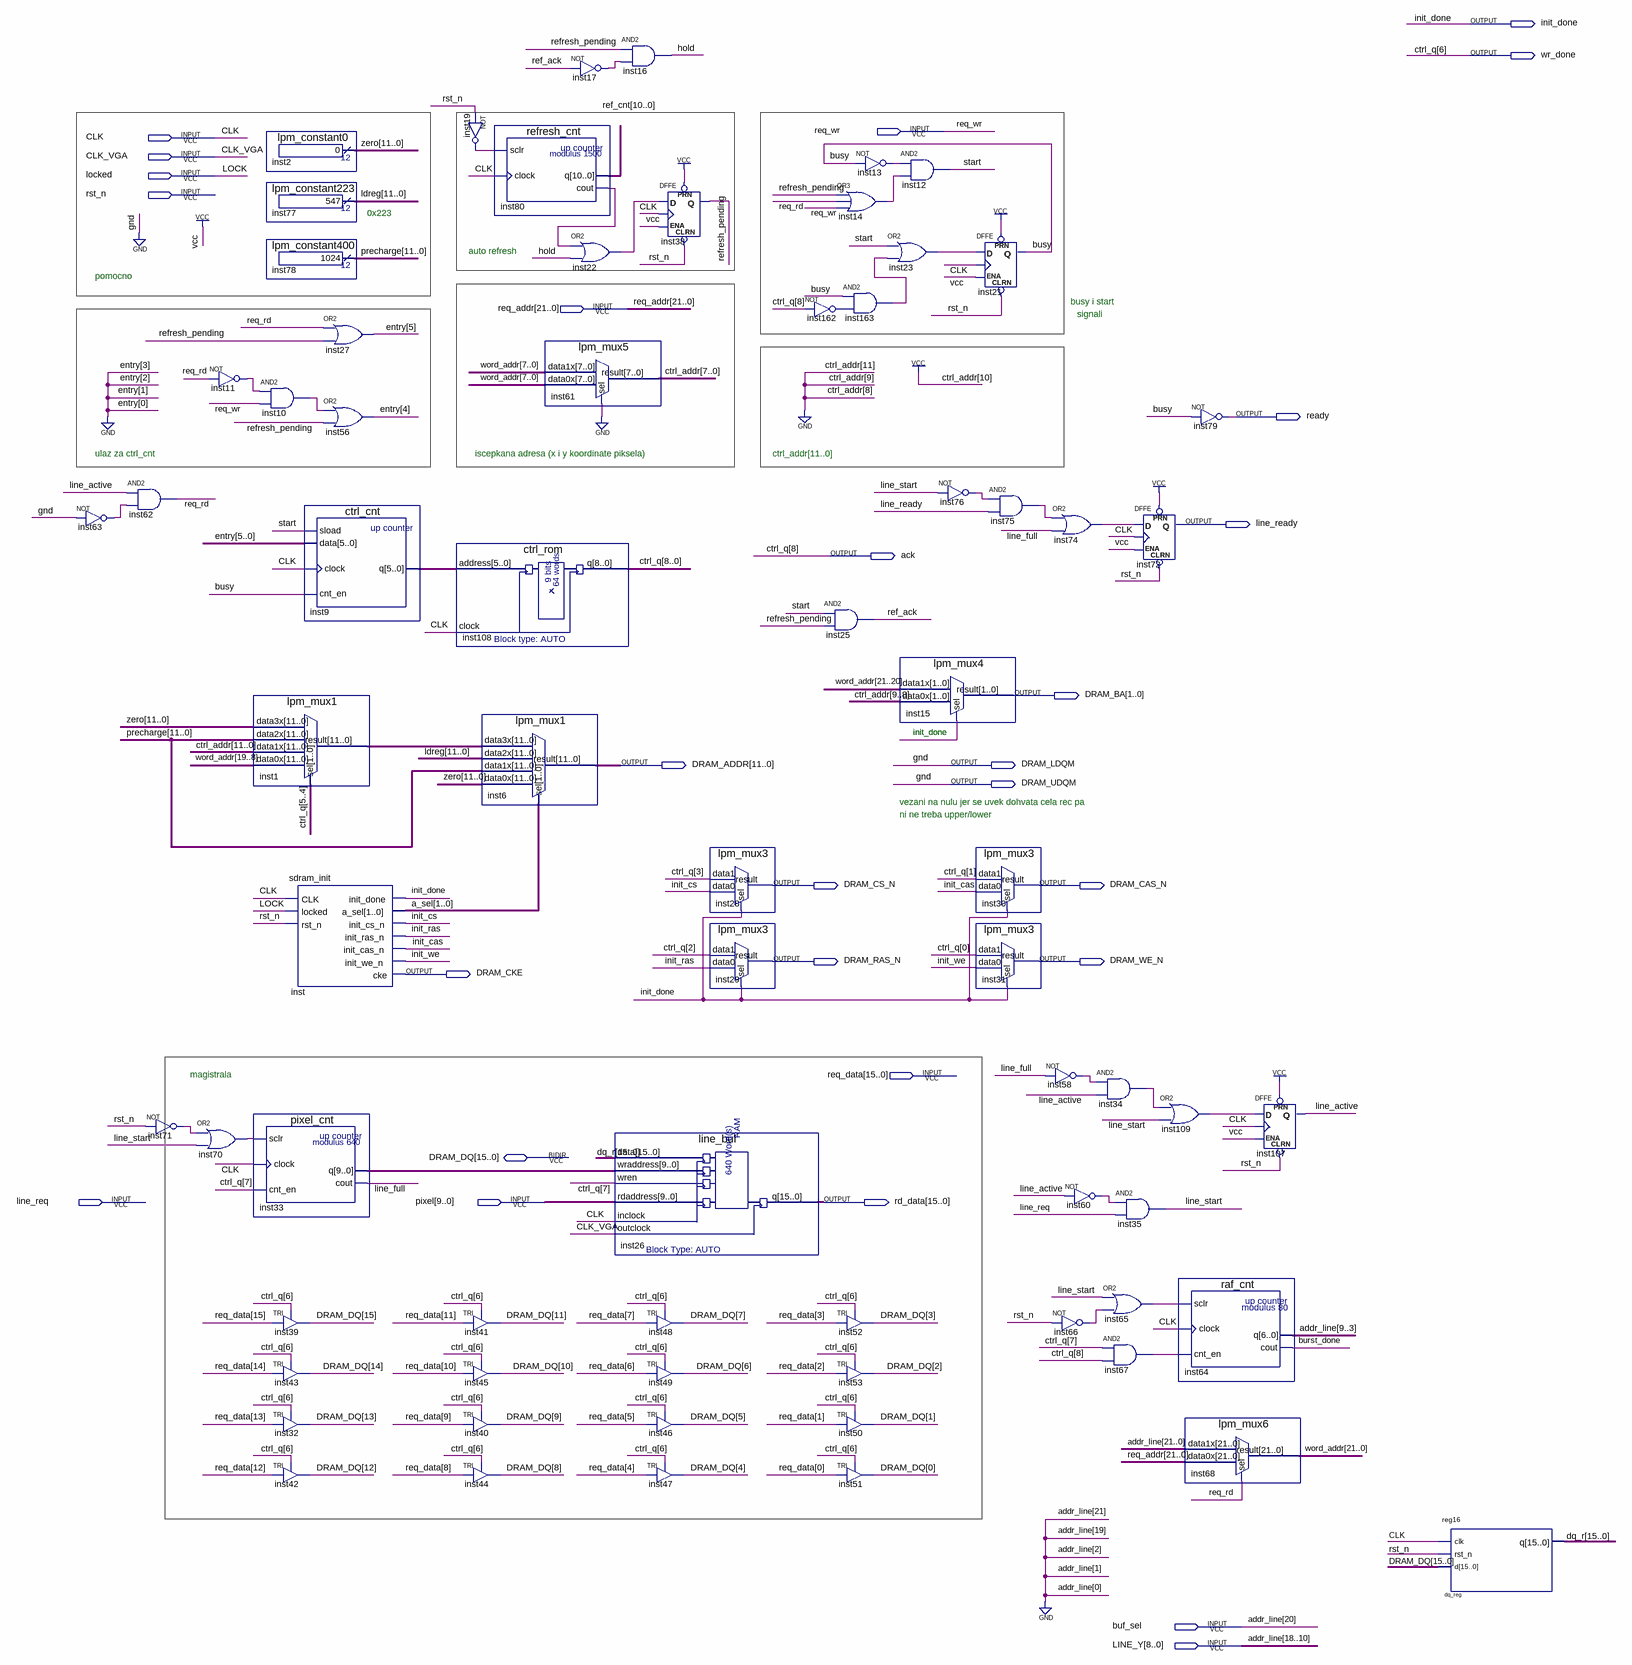
[diagram p0: schematic sheet]
// Quartus schematic sdram_ctrl.bdf as structural Verilog: 71 symbols, 27 pins
module sdram_ctrl (
  input  req_wr,
  input  CLK,
  input  CLK_VGA,
  input  locked,
  input  rst_n,
  input  [21:0] req_addr,
  input  [15:0] req_data,
  input  line_req,
  input  [9:0] pixel,
  input  buf_sel,
  input  [8:0] LINE_Y,
  inout  [15:0] DRAM_DQ,
  output init_done,
  output wr_done,
  output ready,
  output line_ready,
  output ack,
  output [1:0] DRAM_BA,
  output [11:0] DRAM_ADDR,
  output DRAM_LDQM,
  output DRAM_UDQM,
  output DRAM_CS_N,
  output DRAM_CAS_N,
  output DRAM_RAS_N,
  output DRAM_WE_N,
  output DRAM_CKE,
  output [15:0] rd_data
);

  wire burst_done, busy, hold, init_cas, init_cs, init_ras, init_we, inst10_out, inst11_out, inst13_out,
       inst14_out, inst17_out, inst19_out, inst22_out, inst23_out, inst34_out, inst58_out, inst60_out,
       inst63_out, inst65_out, inst66_out, inst67_out, inst70_out, inst71_out, inst74_out, inst75_out,
       inst76_out, inst80_cout, inst109_out, inst162_out, inst163_out, line_active, line_full, line_start,
       ref_ack, refresh_pending, req_rd, start;
  wire [1:0] a_sel;
  wire [5:0] inst9_q;
  wire [5:4] entry;
  wire [7:0] ctrl_addr, ctrl_q;
  wire [9:0] inst33_q;
  wire [9:3] addr_line;
  wire [10:0] ref_cnt;
  wire [11:0] inst1_result, ldreg, precharge, zero;
  wire [15:0] dq_r;
  wire [21:0] word_addr;

  not inst63 (inst63_out, 1'b0);
  and inst62 (req_rd, line_active, inst63_out);
  not inst71 (inst71_out, rst_n);
  not inst11 (inst11_out, req_rd);
  or inst70 (inst70_out, inst71_out, line_start);
  lpm_constant0 inst2 (.result(zero));
  lpm_constant223 inst77 (.result(ldreg));
  lpm_constant400 inst78 (.result(precharge));
  and inst10 (inst10_out, inst11_out, req_wr);
  lpm_mux1 inst1 (
    .data3x(zero), .data2x(precharge), .data1x({4'b0100, ctrl_addr}), .data0x(word_addr[19:8]),
    .sel(ctrl_q[5:4]), .result(inst1_result));
  pixel_cnt inst33 (.sclr(inst70_out), .clock(CLK), .cnt_en(ctrl_q[7]), .cout(line_full), .q(inst33_q));
  TRI inst39 (.IN(req_data[15]), .OE(wr_done), .OUT(DRAM_DQ[15]));
  TRI inst43 (.IN(req_data[14]), .OE(wr_done), .OUT(DRAM_DQ[14]));
  TRI inst32 (.IN(req_data[13]), .OE(wr_done), .OUT(DRAM_DQ[13]));
  TRI inst42 (.IN(req_data[12]), .OE(wr_done), .OUT(DRAM_DQ[12]));
  or inst27 (entry[5], req_rd, refresh_pending);
  or inst56 (entry[4], inst10_out, refresh_pending);
  ctrl_cnt inst9 (.sload(start), .data({entry, 4'b0000}), .clock(CLK), .cnt_en(busy), .q(inst9_q));
  sdram_init inst (
    .CLK(CLK), .locked(locked), .rst_n(rst_n), .init_done(init_done), .a_sel(a_sel), .init_cs_n(init_cs),
    .init_ras_n(init_ras), .init_cas_n(init_cas), .init_we_n(init_we), .cke(DRAM_CKE));
  not inst19 (inst19_out, rst_n);
  ctrl_rom inst108 (.address(inst9_q), .clock(CLK), .q({ack, ctrl_q[7], wr_done, ctrl_q[5:0]}));
  TRI inst41 (.IN(req_data[11]), .OE(wr_done), .OUT(DRAM_DQ[11]));
  TRI inst45 (.IN(req_data[10]), .OE(wr_done), .OUT(DRAM_DQ[10]));
  TRI inst40 (.IN(req_data[9]), .OE(wr_done), .OUT(DRAM_DQ[9]));
  TRI inst44 (.IN(req_data[8]), .OE(wr_done), .OUT(DRAM_DQ[8]));
  refresh_cnt inst80 (.sclr(inst19_out), .clock(CLK), .cout(inst80_cout), .q(ref_cnt));
  lpm_mux1 inst6 (
    .data3x(inst1_result), .data2x(ldreg), .data1x(precharge), .data0x(zero), .sel(a_sel), .result(DRAM_ADDR));
  not inst17 (inst17_out, ref_ack);
  or inst22 (inst22_out, inst80_cout, hold);
  lpm_mux5 inst61 (.data1x(word_addr[7:0]), .data0x(word_addr[7:0]), .sel(1'b0), .result(ctrl_addr));
  and inst16 (hold, refresh_pending, inst17_out);
  line_buf inst26 (
    .data(dq_r), .wraddress(inst33_q), .wren(ctrl_q[7]), .rdaddress(pixel), .inclock(CLK),
    .outclock(CLK_VGA), .q(rd_data));
  DFFE inst38 (.PRN(1'b1), .CLRN(rst_n), .D(inst22_out), .CLK(CLK), .ENA(1'b1), .Q(refresh_pending));
  TRI inst48 (.IN(req_data[7]), .OE(wr_done), .OUT(DRAM_DQ[7]));
  TRI inst49 (.IN(req_data[6]), .OE(wr_done), .OUT(DRAM_DQ[6]));
  TRI inst46 (.IN(req_data[5]), .OE(wr_done), .OUT(DRAM_DQ[5]));
  TRI inst47 (.IN(req_data[4]), .OE(wr_done), .OUT(DRAM_DQ[4]));
  lpm_mux3 inst28 (.data1(ctrl_q[3]), .data0(init_cs), .sel(init_done), .result(DRAM_CS_N));
  lpm_mux3 inst29 (.data1(ctrl_q[2]), .data0(init_ras), .sel(init_done), .result(DRAM_RAS_N));
  not inst162 (inst162_out, ack);
  and inst25 (ref_ack, start, refresh_pending);
  not inst13 (inst13_out, busy);
  or inst14 (inst14_out, refresh_pending, req_rd, req_wr);
  and inst163 (inst163_out, busy, inst162_out);
  TRI inst52 (.IN(req_data[3]), .OE(wr_done), .OUT(DRAM_DQ[3]));
  TRI inst53 (.IN(req_data[2]), .OE(wr_done), .OUT(DRAM_DQ[2]));
  TRI inst50 (.IN(req_data[1]), .OE(wr_done), .OUT(DRAM_DQ[1]));
  TRI inst51 (.IN(req_data[0]), .OE(wr_done), .OUT(DRAM_DQ[0]));
  and inst12 (start, inst13_out, inst14_out);
  or inst23 (inst23_out, start, inst163_out);
  lpm_mux4 inst15 (.data1x(word_addr[21:20]), .data0x(2'b00), .sel(init_done), .result(DRAM_BA));
  DFFE inst21 (.PRN(1'b1), .CLRN(rst_n), .D(inst23_out), .CLK(CLK), .ENA(1'b1), .Q(busy));
  not inst76 (inst76_out, line_start);
  lpm_mux3 inst30 (.data1(ctrl_q[1]), .data0(init_cas), .sel(init_done), .result(DRAM_CAS_N));
  lpm_mux3 inst31 (.data1(ctrl_q[0]), .data0(init_we), .sel(init_done), .result(DRAM_WE_N));
  and inst75 (inst75_out, inst76_out, line_ready);
  or inst74 (inst74_out, inst75_out, line_full);
  not inst58 (inst58_out, line_full);
  not inst60 (inst60_out, line_active);
  not inst66 (inst66_out, rst_n);
  DFFE inst72 (.PRN(1'b1), .CLRN(rst_n), .D(inst74_out), .CLK(CLK), .ENA(1'b1), .Q(line_ready));
  and inst34 (inst34_out, inst58_out, line_active);
  and inst35 (line_start, inst60_out, line_req);
  or inst65 (inst65_out, line_start, inst66_out);
  and inst67 (inst67_out, ctrl_q[7], ack);
  or inst109 (inst109_out, inst34_out, line_start);
  raf_cnt inst64 (.sclr(inst65_out), .clock(CLK), .cnt_en(inst67_out), .cout(burst_done), .q(addr_line));
  lpm_mux6 inst68 (
    .data1x({1'b0, buf_sel, 1'b0, LINE_Y, addr_line, 3'b000}), .data0x(req_addr), .sel(req_rd),
    .result(word_addr));
  not inst79 (ready, busy);
  DFFE inst107 (.PRN(1'b1), .CLRN(rst_n), .D(inst109_out), .CLK(CLK), .ENA(1'b1), .Q(line_active));
  reg16 dq_reg (.clk(CLK), .rst_n(rst_n), .d(DRAM_DQ), .q(dq_r));

  assign DRAM_LDQM = 1'b0;
  assign DRAM_UDQM = 1'b0;

  // Other names for the same wires on the sheet: addr_line (some bits) = {buf_sel, LINE_Y};
  //   ctrl_q (some bits) = {ack, wr_done}; LOCK = locked

  // Notes on the sheet:
  //   0x223
  //   auto refresh
  //   pomocno
  //   busy i start
  //   signali
  //   ulaz za ctrl_cnt
  //   iscepkana adresa (x i y koordinate piksela)
  //   ctrl_addr[11..0]
  //   init_done
  //   vezani na nulu jer se uvek dohvata cela rec pa 
  //   ni ne treba upper/lower
  //   magistrala
endmodule
